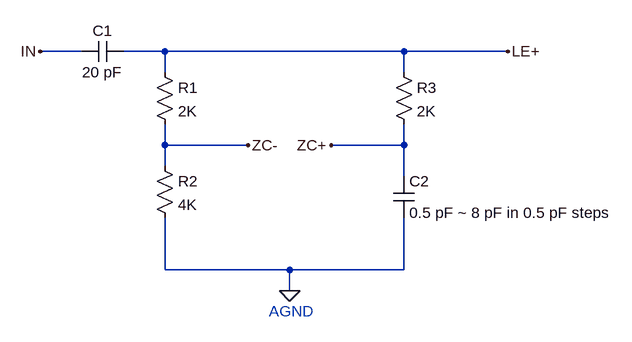
[diagram p0: schematic nowlin_short.asc]
nowlin_short.asc, the LTspice schematic file:
Version 4
SHEET 1 880 680
WIRE 16 80 -48 80
WIRE 144 80 80 80
WIRE 512 80 144 80
WIRE 672 80 512 80
WIRE 144 112 144 80
WIRE 512 112 512 80
WIRE 144 224 144 192
WIRE 272 224 144 224
WIRE 512 224 512 192
WIRE 512 224 400 224
WIRE 144 256 144 224
WIRE 512 272 512 224
WIRE 144 416 144 336
WIRE 336 416 144 416
WIRE 512 416 512 336
WIRE 512 416 336 416
WIRE 336 448 336 416
FLAG -48 80 IN
FLAG 672 80 LE+
FLAG 272 224 ZC-
FLAG 400 224 ZC+
FLAG 336 448 0
SYMBOL cap 80 64 R90
WINDOW 0 0 32 VBottom 2
WINDOW 3 32 32 VTop 2
SYMATTR InstName C1
SYMATTR Value 20 pF
SYMBOL res 128 96 R0
SYMATTR InstName R1
SYMATTR Value 2K
SYMBOL res 128 240 R0
SYMATTR InstName R2
SYMATTR Value 4K
SYMBOL res 496 96 R0
SYMATTR InstName R3
SYMATTR Value 2K
SYMBOL cap 496 272 R0
SYMATTR InstName C2
SYMATTR Value 0.5 pF ~ 8 pF in 0.5 pF steps
TEXT 304 480 Left 2 ;AGND

The netlist it stands for:
* nowlin_short.asc
C1 LE+ IN 20 pF
R1 LE+ ZC- 2K
R2 ZC- 0 4K
R3 LE+ ZC+ 2K
C2 ZC+ 0 0.5 pF ~ 8 pF in 0.5 pF steps
* AGND
.backanno
.end